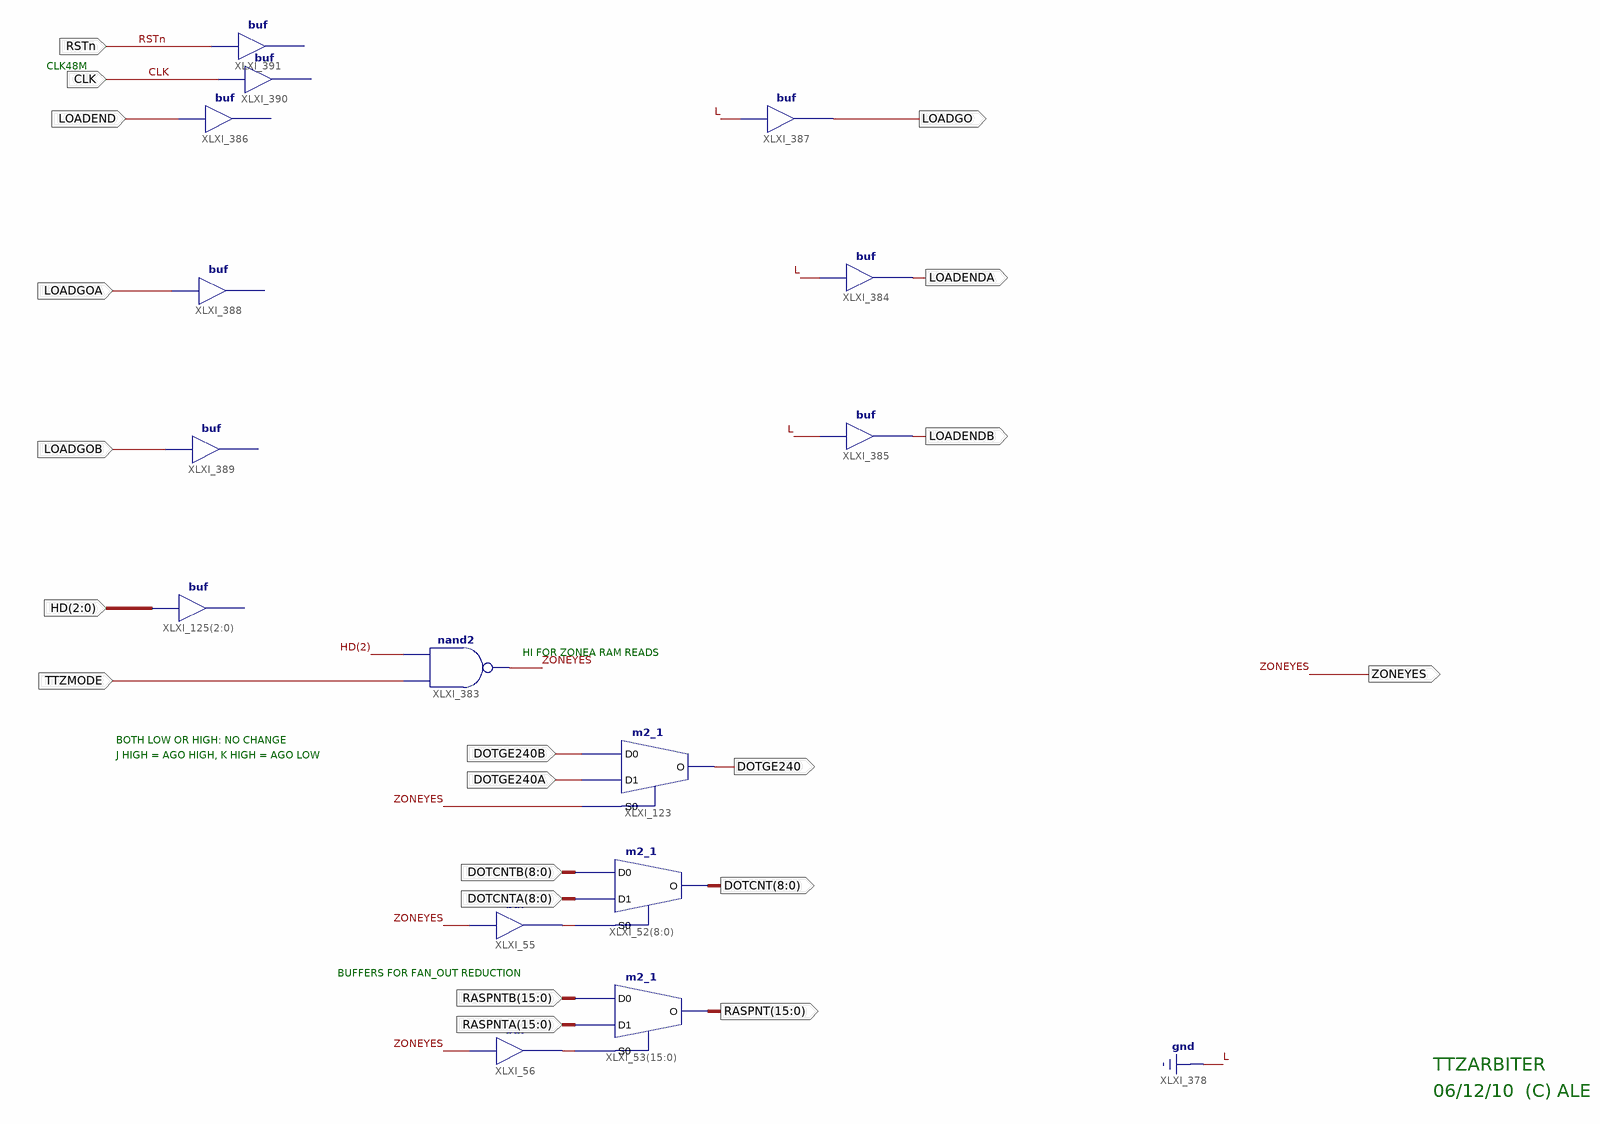
[diagram p0: schematic sheet 1]
// Xilinx ISE schematic TtzArbiter.sch (spartan3e) as structural Verilog: 15 symbols, 20 ports
module TtzArbiter (
  input  RSTn,
  input  CLK,
  input  LOADGOA,
  input  LOADGOB,
  input  LOADEND,
  input  [8:0] DOTCNTB,
  input  [8:0] DOTCNTA,
  input  [15:0] RASPNTB,
  input  [15:0] RASPNTA,
  input  DOTGE240A,
  input  DOTGE240B,
  input  TTZMODE,
  input  [2:0] HD,
  output LOADENDA,
  output LOADENDB,
  output [8:0] DOTCNT,
  output [15:0] RASPNT,
  output DOTGE240,
  output ZONEYES,
  output LOADGO
);

  wire XLXN_16, XLXN_17;

  m2_1 XLXI_53[15:0] (.D0(RASPNTB), .D1(RASPNTA), .S0(XLXN_17), .O(RASPNT));
  m2_1 XLXI_52[8:0] (.D0(DOTCNTB), .D1(DOTCNTA), .S0(XLXN_16), .O(DOTCNT));
  buf XLXI_55 (XLXN_16, ZONEYES);
  buf XLXI_56 (XLXN_17, ZONEYES);
  m2_1 XLXI_123 (.D0(DOTGE240B), .D1(DOTGE240A), .S0(ZONEYES), .O(DOTGE240));
  // buf XLXI_125[2..0] has open pins: I=HD, O=open
  nand XLXI_383 (ZONEYES, TTZMODE, HD[2]);
  buf XLXI_384 (LOADENDA, 1'b0);
  buf XLXI_385 (LOADENDB, 1'b0);
  // buf XLXI_386 has open pins: I=LOADEND, O=open
  buf XLXI_387 (LOADGO, 1'b0);
  // buf XLXI_388 has open pins: I=LOADGOA, O=open
  // buf XLXI_389 has open pins: I=LOADGOB, O=open
  // buf XLXI_390 has open pins: I=CLK, O=open
  // buf XLXI_391 has open pins: I=RSTn, O=open

  // Notes on the sheet:
  //   CLK48M
  //   HI FOR ZONEA RAM READS
  //   BOTH LOW OR HIGH: NO CHANGE
  //   J HIGH = AGO HIGH, K HIGH = AGO LOW
  //   BUFFERS FOR FAN_OUT REDUCTION
  //   TTZARBITER
  //   06/12/10  (C) ALE
endmodule
